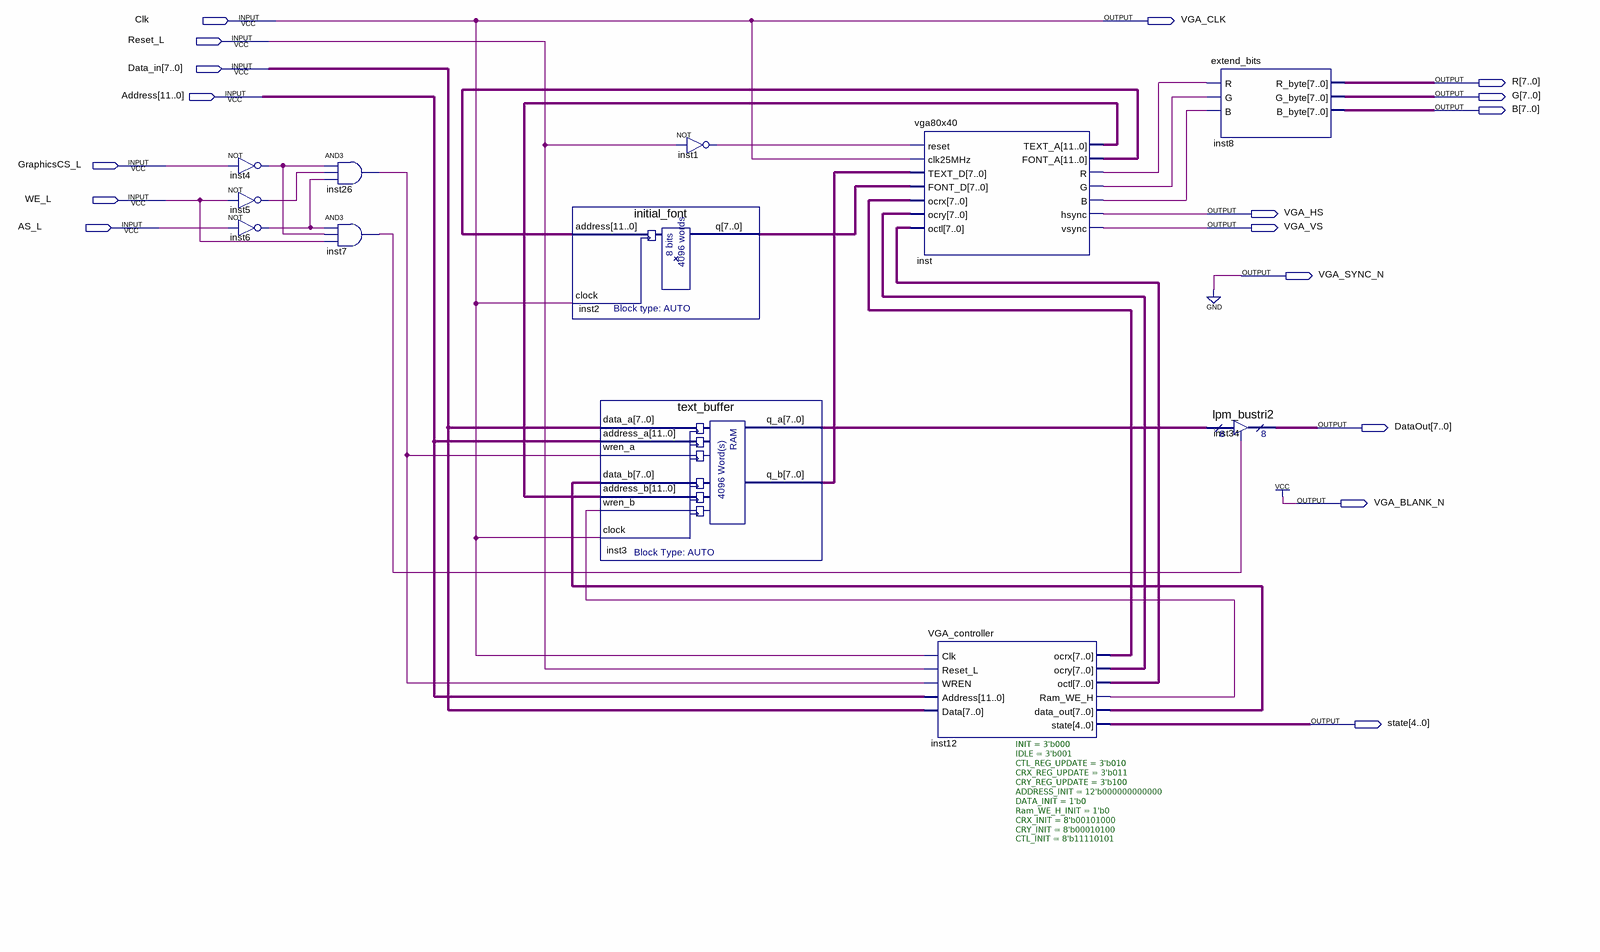
[diagram p0: schematic sheet]
// Quartus schematic vga_interface.bdf as structural Verilog: 12 symbols, 17 pins
module vga_interface (
  input  Clk,
  input  Reset_L,
  input  [7:0] Data_in,
  input  [11:0] Address,
  input  GraphicsCS_L,
  input  WE_L,
  input  AS_L,
  output VGA_CLK,
  output [7:0] R,
  output [7:0] G,
  output [7:0] B,
  output VGA_HS,
  output VGA_VS,
  output VGA_SYNC_N,
  output [7:0] DataOut,
  output VGA_BLANK_N,
  output [4:0] state
);

  wire inst1_out, inst4_out, inst5_out, inst6_out, inst7_out, inst12_ram_we_h, inst26_out, inst_b, inst_g,
       inst_r;
  wire [7:0] inst2_q, inst3_q_a, inst3_q_b, inst12_data_out, inst12_ocrx, inst12_ocry, inst12_octl;
  wire [11:0] inst_font_a, inst_text_a;

  not inst4 (inst4_out, GraphicsCS_L);
  not inst5 (inst5_out, WE_L);
  not inst6 (inst6_out, AS_L);
  and inst26 (inst26_out, inst4_out, inst5_out, inst6_out);
  and inst7 (inst7_out, inst6_out, inst4_out, WE_L);
  initial_font inst2 (.address(inst_font_a), .clock(Clk), .q(inst2_q));
  text_buffer inst3 (
    .data_a(Data_in), .address_a(Address), .wren_a(inst26_out), .data_b(inst12_data_out),
    .address_b(inst_text_a), .wren_b(inst12_ram_we_h), .clock(Clk), .q_a(inst3_q_a), .q_b(inst3_q_b));
  not inst1 (inst1_out, Reset_L);
  vga80x40 inst (
    .reset(inst1_out), .clk25MHz(Clk), .TEXT_D(inst3_q_b), .FONT_D(inst2_q), .ocrx(inst12_ocrx),
    .ocry(inst12_ocry), .octl(inst12_octl), .TEXT_A(inst_text_a), .FONT_A(inst_font_a), .R(inst_r),
    .G(inst_g), .B(inst_b), .hsync(VGA_HS), .vsync(VGA_VS));
  VGA_controller #(.INIT(3'b000), .IDLE(3'b001), .CTL_REG_UPDATE(3'b010), .CRX_REG_UPDATE(3'b011), .CRY_REG_UPDATE(3'b100), .ADDRESS_INIT(12'b000000000000), .DATA_INIT(1'b0), .Ram_WE_H_INIT(1'b0), .CRX_INIT(8'b00101000), .CRY_INIT(8'b00010100), .CTL_INIT(8'b11110101)) inst12 (
    .Clk(Clk), .Reset_L(Reset_L), .WREN(inst26_out), .Address(Address), .Data(Data_in), .ocrx(inst12_ocrx),
    .ocry(inst12_ocry), .octl(inst12_octl), .Ram_WE_H(inst12_ram_we_h), .data_out(inst12_data_out),
    .state(state));
  extend_bits inst8 (.R(inst_r), .G(inst_g), .B(inst_b), .R_byte(R), .G_byte(G), .B_byte(B));
  lpm_bustri2 inst34 (.enabledt(inst7_out), .data(inst3_q_a), .tridata(DataOut));

  assign VGA_BLANK_N = 1'b1;
  assign VGA_CLK = Clk;
  assign VGA_SYNC_N = 1'b0;
endmodule
